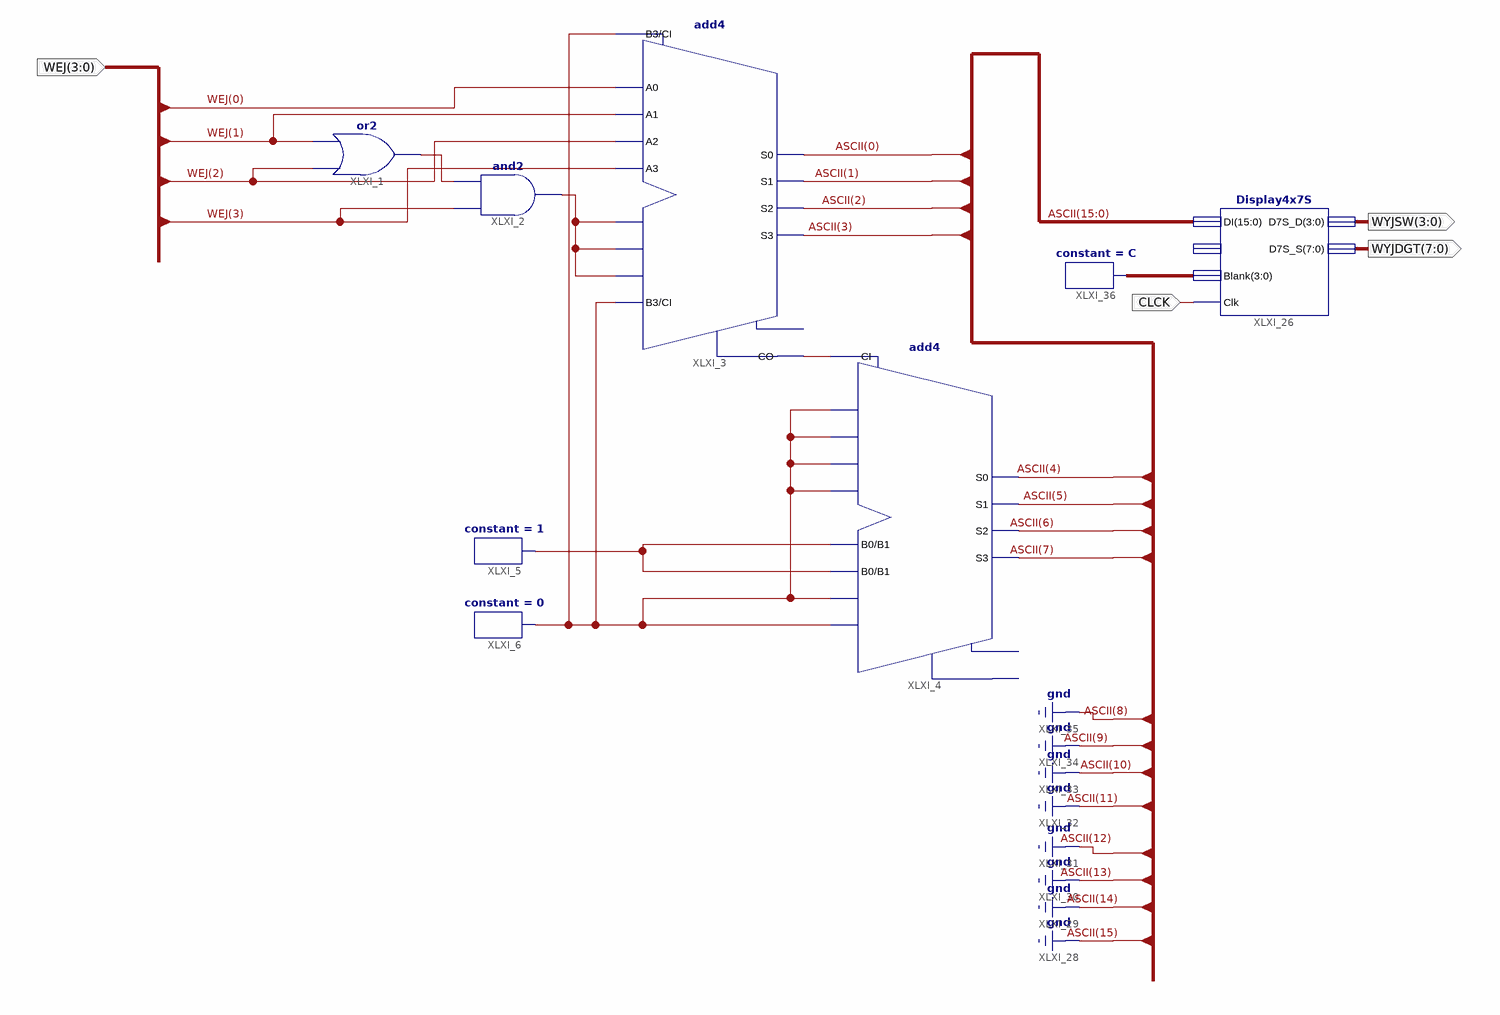
[diagram p0: schematic sheet 1]
// Xilinx ISE schematic scheme_display.sch (xc9500xl) as structural Verilog: 8 symbols, 4 ports
module scheme_display (
  input  [3:0] WEJ,
  input  CLCK,
  output [3:0] WYJSW,
  output [7:0] WYJDGT
);

  wire XLXN_8, XLXN_11, XLXN_27, XLXN_30, XLXN_109;
  wire [3:0] XLXN_113;
  wire [7:0] ASCII;

  add4 XLXI_3 (
    .A0(WEJ[0]), .A1(WEJ[1]), .A2(WEJ[2]), .A3(WEJ[3]), .B0(XLXN_27), .B1(XLXN_27), .B2(XLXN_27),
    .B3(XLXN_30), .CI(XLXN_30), .CO(XLXN_11), .S0(ASCII[0]), .S1(ASCII[1]), .S2(ASCII[2]), .S3(ASCII[3]));  // open: OFL
  add4 XLXI_4 (
    .A0(XLXN_30), .A1(XLXN_30), .A2(XLXN_30), .A3(XLXN_30), .B0(XLXN_8), .B1(XLXN_8), .B2(XLXN_30),
    .B3(XLXN_30), .CI(XLXN_11), .S0(ASCII[4]), .S1(ASCII[5]), .S2(ASCII[6]), .S3(ASCII[7]));  // open: CO, OFL
  constant #(.CValue("1")) XLXI_5 (.O(XLXN_8));
  constant #(.CValue("0")) XLXI_6 (.O(XLXN_30));
  or XLXI_1 (XLXN_109, WEJ[2], WEJ[1]);
  and XLXI_2 (XLXN_27, WEJ[3], XLXN_109);
  Display4x7S XLXI_26 (
    .DI({{8{1'b0}}, ASCII}), .D7S_D(WYJSW), .D7S_S(WYJDGT), .Clk(CLCK), .Blank(XLXN_113));  // open: DP
  constant #(.CValue("C")) XLXI_36 (.O(XLXN_113));
endmodule
